# Altium schematic sheet SWD.SchDoc
size A4; SheetNumber: 4; SheetTotal: 4
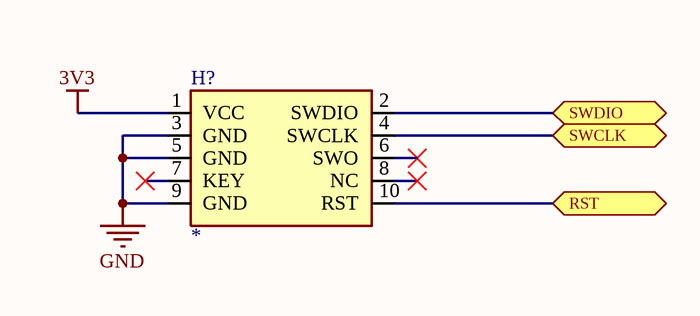
[diagram p0: SWD.SchDoc]

## Parts
H?  *  [SOP10]

## Ports
RST (bidir, see mainSchema[2B]), SWCLK (bidir, see mainSchema[2B], mcu[1B]), SWDIO (bidir, see mainSchema[2B], mcu[1B])

## Nets
3V3: H?.1(VCC)
GND: H?.3(GND) H?.5(GND) H?.9(GND)
RST: H?.10(RST) ; port RST
SWCLK: H?.4(SWCLK) ; port SWCLK
SWDIO: H?.2(SWDIO) ; port SWDIO

Not connected (* = marked no-connect by the designer): H? 6(SWO)* 7(KEY)* 8(NC)*

## Library data of the parts
H? = SWD_HEADER: Value: *; HelpURL: *; MPN: *; Supplier: *; SupplierPartNumber: *